# Altium schematic sheet final.SchDoc
size B
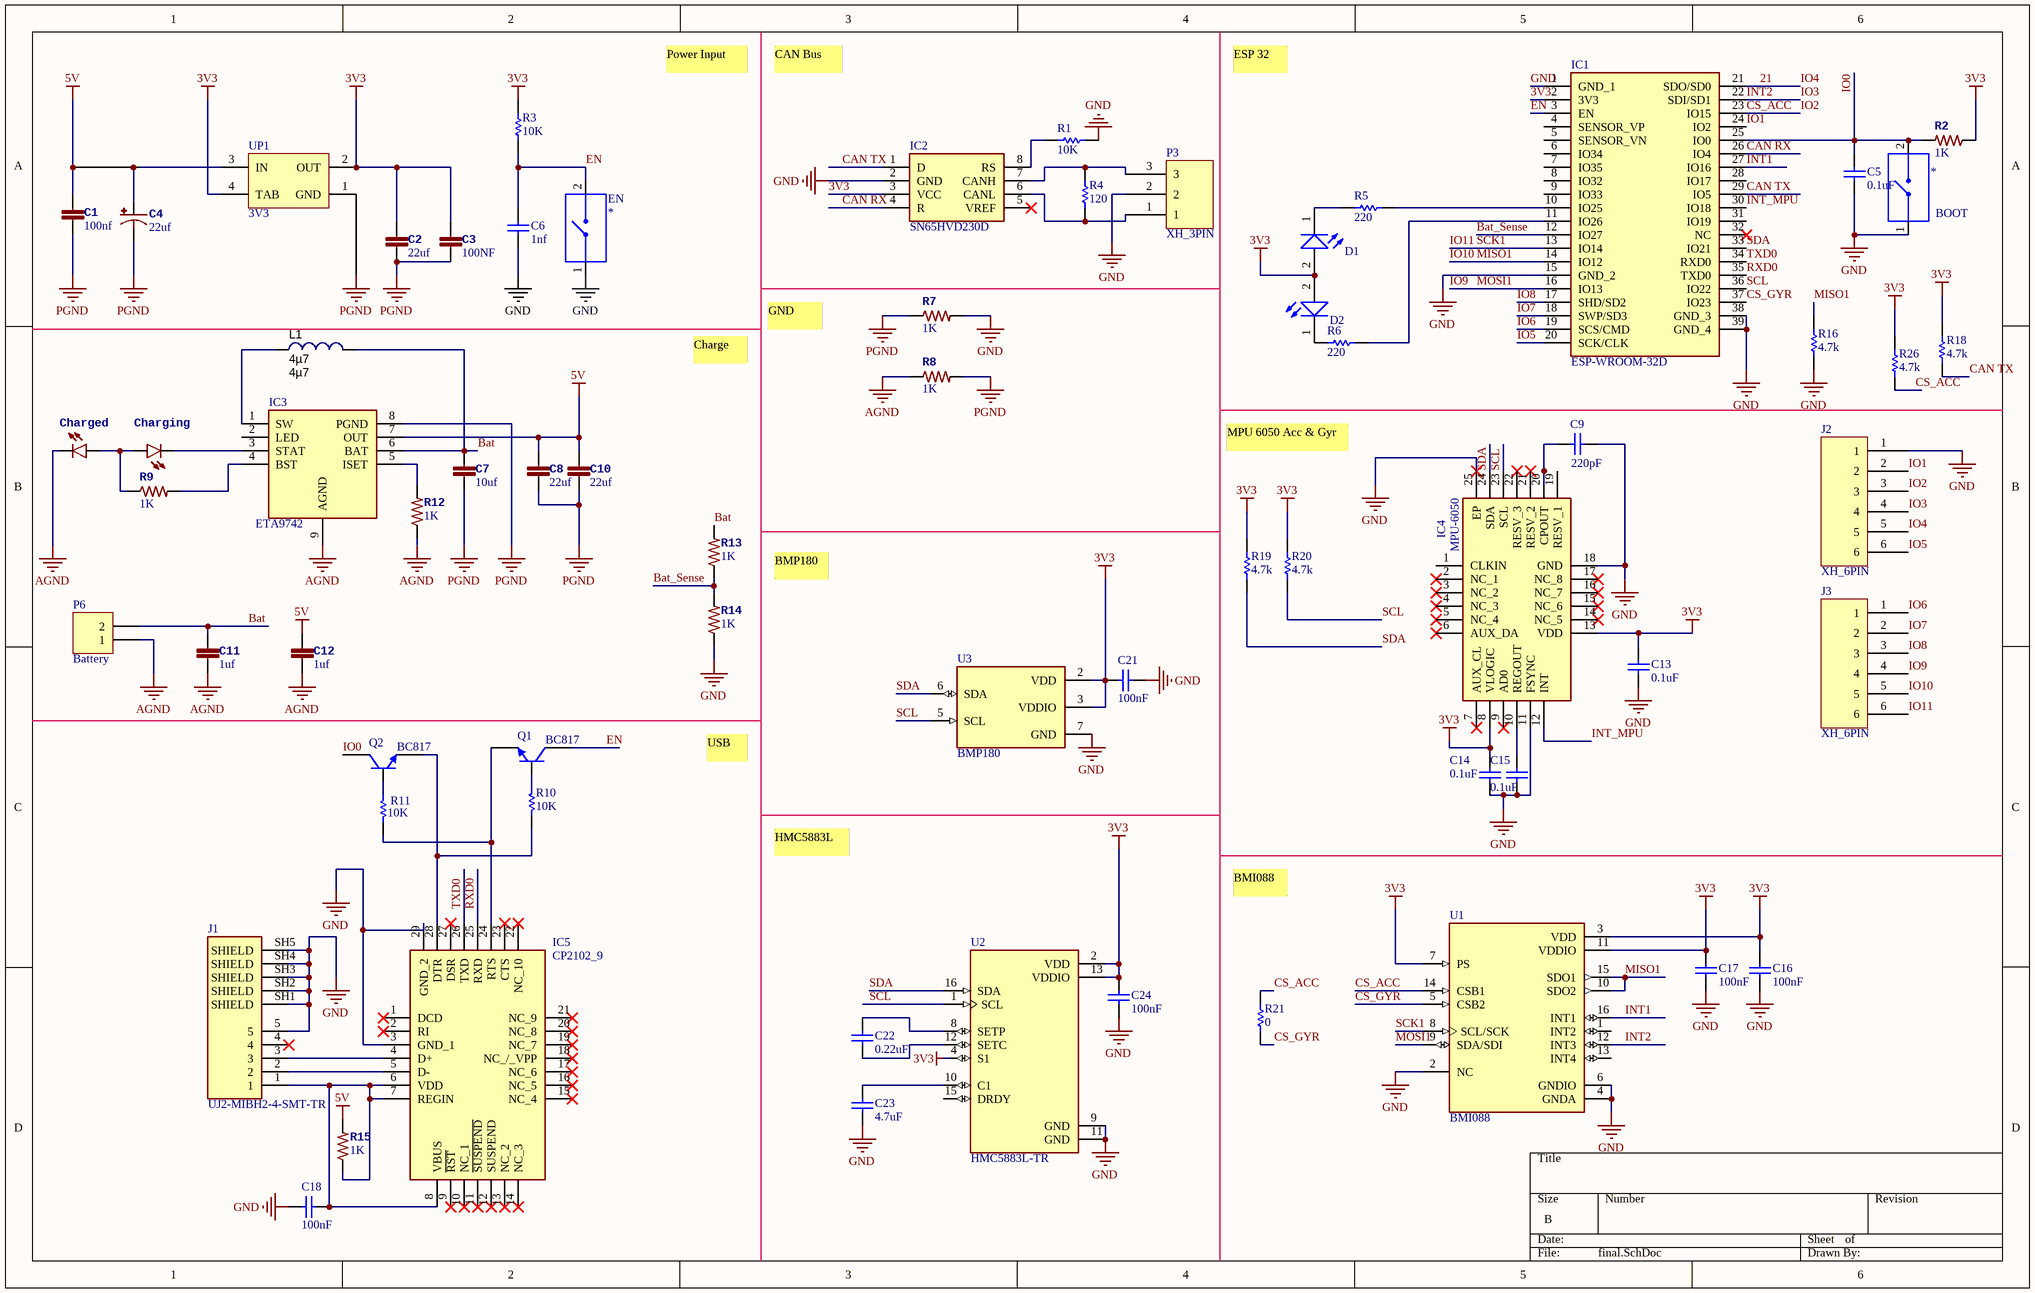
[diagram p0: final.SchDoc]

## Parts
BOOT  1437566-4  [SW_1437566-4]  (value not drawn)
C1  value 100nf  [_0805]  (hidden comment: Cap)
C2  value 22uf  [_0805]  (hidden comment: Cap)
C3  value 100NF  [_0805]  (hidden comment: Cap)
C4  value 22uf  [_EIA3216]  (hidden comment: Cap-Pol)
C5  0.1uF  [C0603]
C6  1nf  [C0603]
C7  value 10uf  [_0805]  (hidden comment: Cap)
C8  value 22uf  [_0805]  (hidden comment: Cap)
C9  220pF  [C0603]
C10  value 22uf  [_0805]  (hidden comment: Cap)
C11  value 1uf  [_0805]  (hidden comment: Cap)
C12  value 1uf  [_0805]  (hidden comment: Cap)
C13  0.1uF  [C0603]
C14  0.1uF  [C0603]
C15  0.1uF  [C0603]
C16  100nF  [C0603]
C17  100nF  [C0603]
C18  100nF  [C0603]
C21  100nF  [C0603]
C22  0.22uF  [C0603]
C23  4.7uF  [C0603]
C24  100nF  [C0603]
Charged  LED  [_LED-0805]  (value not drawn)
Charging  LED  [_LED-0805]  (value not drawn)
D1  LED SMD PACKAGE  [LED_SMD_0805]  (value not drawn)
D2  LED SMD PACKAGE  [LED_SMD_0805]  (value not drawn)
EN  1437566-4  [SW_1437566-4]  (value not drawn)
IC1  ESP-WROOM-32D  [ESPWROOM32D]
IC2  SN65HVD230D  [SOIC127P600X175-8N]
IC3  ETA9742  [SOIC127P600X175-9N]
IC4  MPU-6050  [QFN50P400X400X95-25N]
IC5  CP2102_9  [QFN50P500X500X105-29N-D]
J1  UJ2-MIBH2-4-SMT-TR  [CUI_UJ2-MIBH2-4-SMT-TR]
J2  XH_6PIN  [XH_6PIN]
J3  XH_6PIN  [XH_6PIN]
L1  4µ7  [Inductor SMD 3x3.2mm]
P3  XH_3PIN  [XH_3PIN]
P6  Battery  [HDR1X2]
Q1  BC817  [SOT23_N]
Q2  BC817  [SOT23_N]
R1  value 10K  [SMD-0603-RES]  (hidden comment: Resistor SMD 0603)
R2  value 1K  [_0805]  (hidden comment: Resistor)
R3  10K  [RES0805]
R4  value 120  [SMD-0603-RES]  (hidden comment: Resistor SMD 0603)
R5  value 220  [SMD-0603-RES]  (hidden comment: Resistor SMD 0603)
R6  value 220  [SMD-0603-RES]  (hidden comment: Resistor SMD 0603)
R7  value 1K  [_0805]  (hidden comment: Resistor)
R8  value 1K  [_0805]  (hidden comment: Resistor)
R9  value 1K  [_0805]  (hidden comment: Resistor)
R10  value 10K  [SMD-0603-RES]  (hidden comment: Resistor SMD 0603)
R11  value 10K  [SMD-0603-RES]  (hidden comment: Resistor SMD 0603)
R12  value 1K  [_0805]  (hidden comment: Resistor)
R13  value 1K  [_0805]  (hidden comment: Resistor)
R14  value 1K  [_0805]  (hidden comment: Resistor)
R15  value 1K  [_0805]  (hidden comment: Resistor)
R16  value 4.7k  [SMD-0603-RES]  (hidden comment: Resistor SMD 0603)
R18  value 4.7k  [SMD-0603-RES]  (hidden comment: Resistor SMD 0603)
R19  value 4.7k  [SMD-0603-RES]  (hidden comment: Resistor SMD 0603)
R20  value 4.7k  [SMD-0603-RES]  (hidden comment: Resistor SMD 0603)
R21  value 0  [SMD-0603-RES]  (hidden comment: Resistor SMD 0603)
R26  value 4.7k  [SMD-0603-RES]  (hidden comment: Resistor SMD 0603)
U1  BMI088  [PQFN50P450X300X100-16N]
U2  HMC5883L-TR  [XDCR_HMC5883L-TR]
U3  BMP180  [BMP180]
UP1  3V3  [SOT223_N]

## Nets
3V3: C2.1 C3.1 C13.2 C14.1 C16.2 C17.2 C21.2 C24.1 D1.2(A) D2.2(A) IC1.2(3V3) IC2.3(VCC) IC4.8(VLOGIC) IC4.13(VDD) R2.1 R3.2 R18.2 R19.2 R20.2 R26.2 U1.3(VDD) U1.7(PS) U1.11(VDDIO) U2.2(VDD) U2.4(S1) U2.13(VDDIO) U3.2(VDD) U3.3(VDDIO) UP1.2(OUT) UP1.4(TAB)
5V: C1.1 C4.+ C8.1 C10.1 C12.1 IC3.7(OUT) R15.2 UP1.3(IN)
AGND: C11.2 C12.2 Charged.K IC3.9(AGND) P6.1 R8.1 R12.1
GND: BOOT.1 C5.1 C6.1 C9.1 C13.1 C14.2 C15.1 C16.1 C17.1 C18.2 C21.1 C23.1 C24.2 EN.1 IC1.1(GND_1) IC1.15(GND_2) IC1.38(GND_3) IC1.39(GND_4) IC2.2(GND) IC4.11(FSYNC) IC4.18(GND) IC4.25(EP) IC5.3(GND_1) IC5.29(GND_2) J1.5 J1.SH1(SHIELD) J1.SH2(SHIELD) J1.SH3(SHIELD) J1.SH4(SHIELD) J1.SH5(SHIELD) J2.1 P3.2 R1.1 R7.2 R14.1 R16.1 U1.2(NC) U1.4(GNDA) U1.6(GNDIO) U2.9(GND) U2.11(GND) U3.7(GND)
PGND: C1.2 C2.2 C3.2 C4.- C7.2 C8.2 C10.2 IC3.8(PGND) R7.1 R8.2 UP1.1(GND)
21: IC1.21(SDO/SD0) J2.5  [also labelled IO4]
Bat: C7.1 C11.1 IC3.6(BAT) L1.2 P6.2 R13.2
Bat_Sense: IC1.12(IO27) R13.1 R14.2
CAN RX: IC1.26(IO4) IC2.4(R)
CAN TX: IC1.29(IO5) IC2.1(D) R18.1
CS_ACC: IC1.23(IO15) J2.3 R21.2 R26.1 U1.14(CSB1)  [also labelled IO2]
CS_GYR: IC1.37(IO23) R21.1 U1.5(CSB2)
EN: C6.2 EN.2 IC1.3(EN) Q1.3(C) R3.1
INT1: IC1.27(IO16) U1.16(INT1)
INT2: IC1.22(SDI/SD1) J2.4 U1.12(INT3)  [also labelled IO3]
INT_MPU: IC1.30(IO18) IC4.12(INT)
IO0: BOOT.2 C5.2 IC1.25(IO0) Q2.3(C) R2.2
IO1: IC1.24(IO2) J2.2
IO5: IC1.20(SCK/CLK) J2.6
IO6: IC1.19(SCS/CMD) J3.1
IO7: IC1.18(SWP/SD3) J3.2
IO8: IC1.17(SHD/SD2) J3.3
IO9: IC1.16(IO13) J3.4 U1.9(SDA/SDI)  [also labelled MOSI1]
IO10: IC1.14(IO12) J3.5 R16.2 U1.10(SDO2) U1.15(SDO1)  [also labelled MISO1]
IO11: IC1.13(IO14) J3.6 U1.8(SCL/SCK)  [also labelled SCK1]
RXD0: IC1.35(TXD0) IC5.25(RXD)
SCL: IC1.36(IO22) IC4.23(SCL) R20.1 U2.1(SCL) U3.5(SCL)
SDA: IC1.33(IO21) IC4.24(SDA) R19.1 U2.16(SDA) U3.6(SDA)
TXD0: IC1.34(RXD0) IC5.26(TXD)
NetC9_2: C9.2 IC4.20(CPOUT)
NetC15_2: C15.2 IC4.10(REGOUT)
NetC18_1: C18.1 IC5.6(VDD) IC5.7(REGIN) IC5.8(VBUS) J1.1 R15.1
NetC22_1: C22.1 U2.12(SETC)
NetC22_2: C22.2 U2.8(SETP)
NetC23_2: C23.2 U2.10(C1)
NetCharged_A: Charged.A Charging.A R9.1
NetCharging_K: Charging.K IC3.3(STAT)
NetD1_1: D1.1(K) R5.2
NetD2_1: D2.1(K) R6.2
NetIC1_10: IC1.10(IO25) R5.1
NetIC1_11: IC1.11(IO26) R6.1
NetIC2_6: IC2.6(CANL) P3.1 R4.1
NetIC2_7: IC2.7(CANH) P3.3 R4.2
NetIC2_8: IC2.8(RS) R1.2
NetIC3_1: IC3.1(SW) L1.1
NetIC3_4: IC3.4(BST) R9.2
NetIC3_5: IC3.5(ISET) R12.2
NetIC5_4: IC5.4(D+) J1.3
NetIC5_5: IC5.5(D-) J1.2
NetIC5_24: IC5.24(RTS) Q1.2(E) R11.1
NetIC5_28: IC5.28(DTR) Q2.2(E) R10.1
NetQ1_1: Q1.1(B) R10.2
NetQ2_1: Q2.1(B) R11.2

Not connected (* = marked no-connect by the designer): IC1 4(SENSOR_VP) 5(SENSOR_VN) 6(IO34) 7(IO35) 8(IO32) 9(IO33) 28(IO17) 31(IO19) 32(NC)*; IC2 5(VREF)*; IC3 2(LED); IC4 1(CLKIN) 2(NC_1)* 3(NC_2)* 4(NC_3)* 5(NC_4)* 6(AUX_DA)* 7(AUX_CL)* 9(AD0)* 14(NC_5)* 15(NC_6)* 16(NC_7)* 17(NC_8)* 19(RESV_1) 21(RESV_2)* 22(RESV_3)*; IC5 1(DCD)* 2(RI)* 9(~{RST})* 10(NC_1)* 11(~{SUSPEND})* 12(SUSPEND)* 13(NC_2)* 14(NC_3)* 15(NC_4)* 16(NC_5)* 17(NC_6)* 18(NC_/_VPP)* 19(NC_7)* 20(NC_8)* 21(NC_9)* 22(NC_10)* 23(CTS)* 27(DSR)*; J1 4*; U1 1(INT2) 13(INT4); U2 15(DRDY)

## Notes on the sheet
- Power Input
- CAN Bus
- ESP 32
- Charge
- GND
- MPU 6050 Acc & Gyr
- BMP180
- USB
- HMC5883L
- BMI088

## Library data of the parts
BOOT EN = 1437566-4: Switch Tactile OFF _ON_ SPST Rectangular Button Gull Wing 0.05A 12VDC 1.77N SMD T/R; MF: TE Connectivity; Configuration_Pole-Throw: Single Pole - Single Throw; Contact_Current_Rating: 50 mA; MP: FSMSMTR; Package: None; Digi-Key_Part_Number: 450-1758-1-ND; Digi-Key_Purchase_URL: https://www.digikey.com/product-detail/en/te-connectivity-alcoswitch-switches/FSMSMTR/450-1758-1-ND/2271637?utm_source=snapeda&utm_medium=aggregator&utm_campaign=symbol; Value: *; TE_purchase_URL: https://www.te.com/usa-en/product-1437566-4.html?te_bu=Cor&te_type=disp&te_campaign=seda_glo_cor-seda-global-disp-prtnr-fy19-seda-model-bom-cta_sma-317_1&elqCampaignId=32493; SnapEDA_Link: https://www.snapeda.com/parts/FSMSMTR/TE%20Connectivity%20ALCOSWITCH%20Switches/view-part/2118497/?ref=snap; Comment_1: *
C1-C3 C7 C8 C10-C12 = Cap_1
C5 C6 C9 C13-C18 C21-C24 = CAP SMD 0805: CAP 0805; Designer: Abbas Basereh; Desc.: CAP SMD 0805; Data: 16-12-2016
Charged Charging = LED: PROD_ID: DIO-09955
D1 D2 = LED SMD PACKAGE: SMD Mono-color Chip LED Waterclear; Part Number: 150080BS75000; Peak Wavelength: 465 nm; Forward Voltage: 3.2 V; Published Date: Jan 2017; Publisher: Ali Hafizi
IC1 = ESP-WROOM-32D: Integrated Circuit; Manufacturer_Name: Espressif Systems; Datasheet Link: https://componentsearchengine.com/Datasheets/1/ESP-WROOM-32D.pdf; Height: 3.2mm; Manufacturer_Part_Number: ESP-WROOM-32D; Mouser Part Number: 356-ESP-WROOM-32D; Mouser Price/Stock: https://www.mouser.co.uk/ProductDetail/Espressif-Systems/ESP-WROOM-32D?qs=MLItCLRbWsyWVKgdQMcFuQ%3D%3D
IC2 = SN65HVD230D: Integrated Circuit; Manufacturer_Name: Texas Instruments; Datasheet Link: http://www.ti.com/lit/ds/symlink/sn65hvd230.pdf; Height: 1.75mm; Manufacturer_Part_Number: SN65HVD230D; Mouser Part Number: 595-SN65HVD230D; Mouser Price/Stock: https://www.mouser.co.uk/ProductDetail/Texas-Instruments/SN65HVD230D?qs=QViXGNcIEAskSxPh50NSwA%3D%3D; Arrow Part Number: SN65HVD230D; Arrow Price/Stock: https://www.arrow.com/en/products/sn65hvd230d/texas-instruments?region=nac
IC3 = ETA9742: Integrated Circuit; Manufacturer_Name: ETA Solutions; Datasheet Link: https://cdn.datasheetspdf.com/pdf-down/E/T/A/ETA9742-ETA.pdf; Height: 1.75mm; Manufacturer_Part_Number: ETA9742
IC4 = MPU-6050: Integrated Circuit; Manufacturer_Name: TDK; Datasheet Link: https://datasheet.lcsc.com/szlcsc/TDK-InvenSense-MPU-6050_C24112.pdf; Height: 0.95mm; Manufacturer_Part_Number: MPU-6050; Mouser Part Number: 410-MPU-6050; Mouser Price/Stock: https://www.mouser.co.uk/ProductDetail/TDK-InvenSense/MPU-6050?qs=u4fy%2FsgLU9O14B5JgyQFvg%3D%3D; Arrow Part Number: MPU-6050; Arrow Price/Stock: https://www.arrow.com/en/products/mpu-6050/invensense?region=nac
IC5 = CP2102_9: Integrated Circuit; Manufacturer_Name: Silicon Labs; Manufacturer_Part_Number: CP2102/9; Datasheet Link: https://www.silabs.com/documents/public/data-sheets/CP2102-9.pdf; Height: 1.05mm
J1 = UJ2-MIBH2-4-SMT-TR: Micro B, USB 2.0, 1.8 A, Right Angle, Surface Mount _SMT_, USB Receptacle; MF: CUI Devices; MP: UJ2-MIBH2-4-SMT-TR; SnapEDA_Link: https://www.snapeda.com/parts/UJ2-MIBH2-4-SMT-TR/CUI%20Devices/view-part/702231/?ref=snap; Price: None; Availability: Unavailable; CUI_purchase_URL: https://www.cuidevices.com/product/interconnect/connectors/usb-connectors/uj2-mibh2-4-smt?utm_source=snapeda.com&utm_medium=referral&utm_campaign=snapedaBOM; Package: None; Value: *
L1 = Inductor 4.7µH SMD 3x3.2mm: Tolerance: ±20%; Type: Ferrite Core; SCDType: source; Package / Case: Inductor 4.7µH SMD 3x3.2mm; Supplier 1: Digi-Key; Operating Temperature: -40°C ~ 125°C; Value: 4µ7
P6 = Header 2: Header, 2-Pin; LatestRevisionDate: 17-Jul-2002; LatestRevisionNote: Re-released for DXP Platform.; Publisher: Altium Limited
Q1 Q2 = BC817: 45 V, 500 mA NPN general-purpose transistors; Published: 2017-2-8; LatestRevisionDate: 2017; LatestRevisionNote: IPC-7351 Footprint Added.; DatasheetVersion: 2017; PackageVersion: 2017-2-8; PackageReference: SOT23; Publisher: Abbas Basereh; PackageDescription: 3-Pin SOT-23 Package 0.95 mm Pitch, 2.3 mm Lead Span; ComponentLink1Description: Manufacturer Link; ComponentLink1URL: http://www.nxp.com/; ComponentLink2Description: Datasheet; ComponentLink2URL: http://www.nxp.com/
R3 = RES SMD PACKAGE: TOTAL SMD RESISTOR PACK; Designer: Abbas Basereh; Desc.: RES SMD PAKAGES; Data: 2017-3-10
U1 = BMI088: Accelerometer, Gyroscope, 6 Axis Sensor IÂ²C, SPI Output; MF: Bosch Sensortec; Package: VFLGA-16 Bosch Sensortec; Purchase-URL: https://pricing.snapeda.com/search/part/BMI088/?ref=eda; Value: *; MP: BMI088; Price: None; SnapEDA_Link: https://www.snapeda.com/parts/BMI088/Bosch%20Sensortec/view-part/2774026/?ref=snap; Check_prices: https://www.snapeda.com/parts/BMI088/Bosch%20Sensortec/view-part/2774026/?ref=eda; Availability: In Stock
U2 = HMC5883L-TR: Magnetoresistive Sensor X, Y, Z Axis 16-LCC; MF: Honeywell; MP: HMC5883LTR; Availability: Unavailable; Value: *; SnapEDA_Link: https://www.snapeda.com/parts/HMC5883LTR/Honeywell/view-part/1099769/?ref=snap; Price: None; Package: LCC-16 Honeywell
U3 = BMP180: Pressure Sensor 4.35PSI ~ 15.95PSI _30kPa ~ 110kPa_ Absolute 16 ~ 19 b 7-VLGA; MF: Bosch Sensortec; Digi-Key_Purchase_URL: https://www.digikey.com/product-detail/en/bosch-sensortec/BMP180/828-1027-1-ND/2688260?utm_source=snapeda&utm_medium=aggregator&utm_campaign=symbol; Digi-Key_Part_Number: 828-1027-1-ND; Package: VLGA-7 Bosch Sensortec; SnapEDA_Link: https://www.snapeda.com/parts/BMP180/Bosch%20Sensortec/view-part/587596/?ref=snap; Value: *; MP: BMP180
UP1 = AMS1117-x.x: x.x Volt, 800mA Low-Dropout Linear Regulator, 4-pin SOT-223; Designer: Ali Hafizi; Data: 16-12-2016
R1 R4-R6 R10 R11 R16 R18-R21 R26 = Resistor SMD 0603: DatasheetVersion: 2021; ComponentLink1Description: Website: Tarahiboard; ComponentLink1URL: https://www.tarahiboard.com/; ComponentLink2Description: Telegram; ComponentLink2URL: https://t.me/tarahiboard; ComponentLink3Description: Instagram; ComponentLink3URL: https://instagram.com/tarahiboard